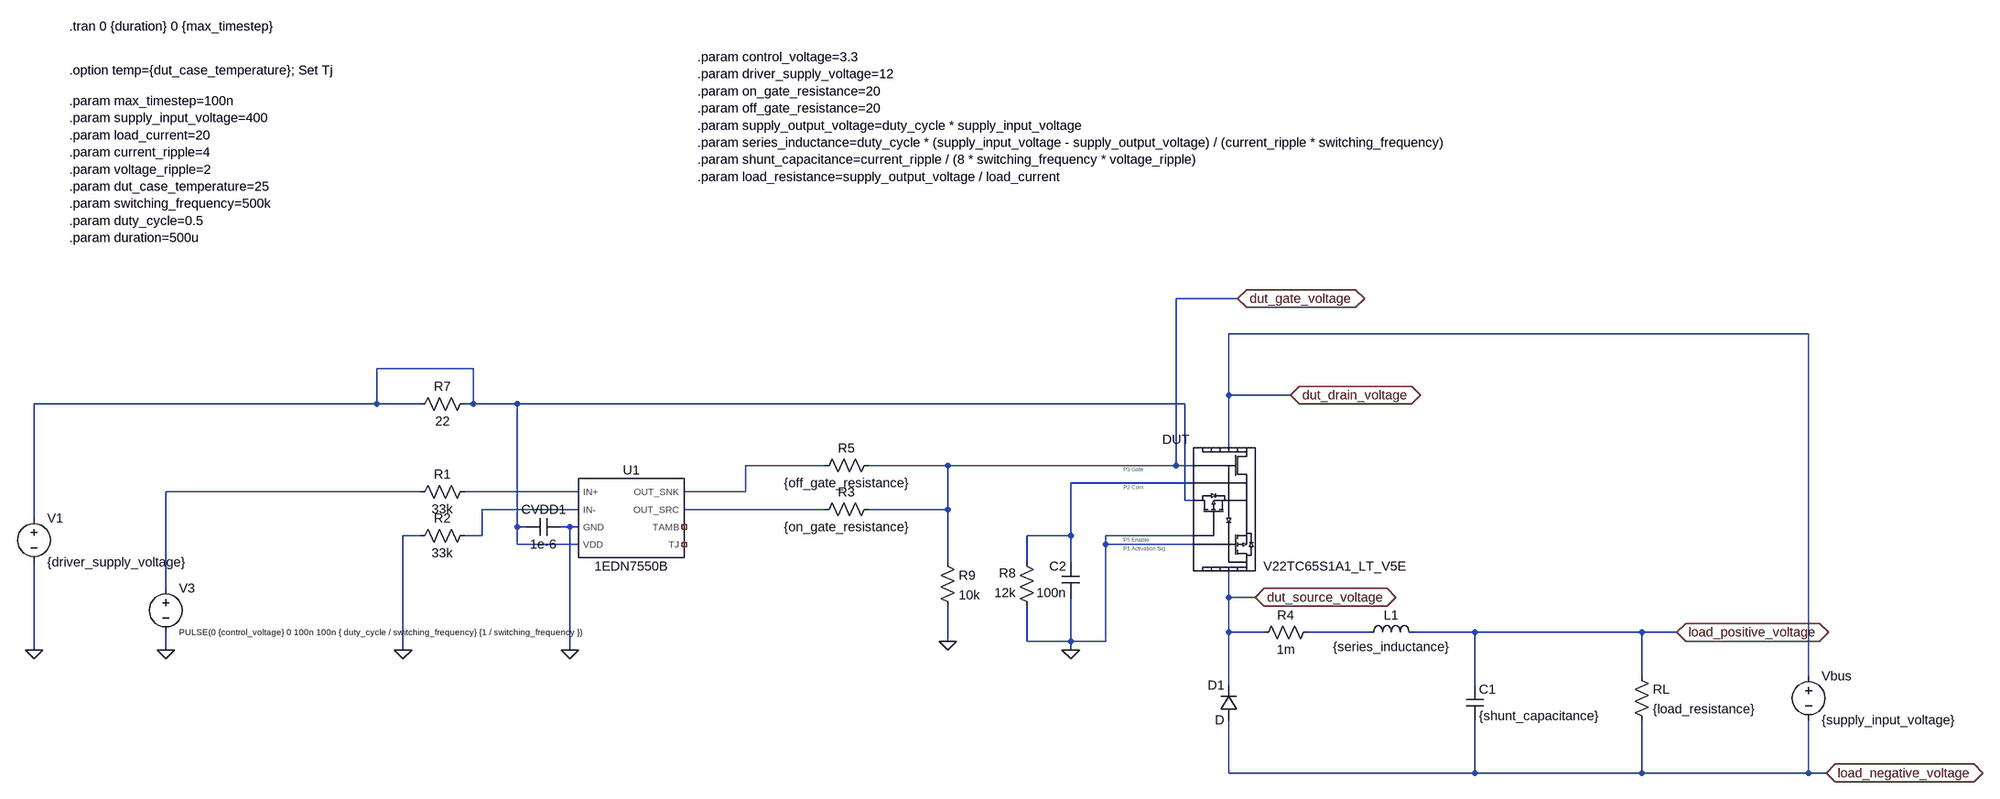
[diagram p0: schematic buck_converter_gan_v22tc65s1a1.asc]
buck_converter_gan_v22tc65s1a1.asc, the LTspice schematic file:
Version 4
SHEET 1 2260 1096
WIRE 864 160 752 160
WIRE 1904 224 848 224
WIRE -528 288 -704 288
WIRE 848 336 848 224
WIRE 960 336 848 336
WIRE -704 352 -704 288
WIRE -704 352 -1328 352
WIRE -624 352 -704 352
WIRE -528 352 -528 288
WIRE -528 352 -544 352
WIRE -448 352 -528 352
WIRE 768 352 -448 352
WIRE 848 432 848 336
WIRE 112 464 -32 464
WIRE 336 464 192 464
WIRE 752 464 752 160
WIRE 752 464 336 464
WIRE 784 464 752 464
WIRE 784 496 560 496
WIRE -624 512 -1088 512
WIRE -336 512 -544 512
WIRE -32 512 -32 464
WIRE -32 512 -144 512
WIRE 768 528 768 352
WIRE 784 528 768 528
WIRE -336 544 -512 544
WIRE 112 544 -144 544
WIRE 336 544 336 464
WIRE 336 544 192 544
WIRE -1328 560 -1328 352
WIRE -448 576 -448 352
WIRE -432 576 -448 576
WIRE -352 576 -368 576
WIRE -336 576 -352 576
WIRE -624 592 -656 592
WIRE -512 592 -512 544
WIRE -512 592 -544 592
WIRE 560 592 560 496
WIRE 560 592 480 592
WIRE 784 592 624 592
WIRE -448 608 -448 576
WIRE -336 608 -448 608
WIRE 624 608 624 592
WIRE 784 608 624 608
WIRE 336 640 336 544
WIRE 480 640 480 592
WIRE 560 640 560 592
WIRE -1088 688 -1088 512
WIRE 848 704 848 656
WIRE 896 704 848 704
WIRE 848 768 848 704
WIRE 912 768 848 768
WIRE 1104 768 992 768
WIRE 1296 768 1184 768
WIRE 1600 768 1296 768
WIRE 1664 768 1600 768
WIRE 336 784 336 720
WIRE 480 784 480 720
WIRE 560 784 560 704
WIRE 560 784 480 784
WIRE 624 784 624 608
WIRE 624 784 560 784
WIRE -1328 800 -1328 640
WIRE -1088 800 -1088 768
WIRE -656 800 -656 592
WIRE -352 800 -352 576
WIRE 560 800 560 784
WIRE 1600 848 1600 768
WIRE 1904 848 1904 224
WIRE 848 864 848 768
WIRE 1296 864 1296 768
WIRE 848 1024 848 928
WIRE 1296 1024 1296 928
WIRE 1296 1024 848 1024
WIRE 1600 1024 1600 928
WIRE 1600 1024 1296 1024
WIRE 1904 1024 1904 928
WIRE 1904 1024 1600 1024
WIRE 1936 1024 1904 1024
FLAG -656 800 0
FLAG -1088 800 0
FLAG -1328 800 0
FLAG -352 800 0
FLAG 960 336 dut_drain_voltage
IOPIN 960 336 BiDir
FLAG 896 704 dut_source_voltage
IOPIN 896 704 BiDir
FLAG 864 160 dut_gate_voltage
IOPIN 864 160 BiDir
FLAG 560 800 0
FLAG 336 784 0
FLAG 1936 1024 load_negative_voltage
IOPIN 1936 1024 BiDir
FLAG 1664 768 load_positive_voltage
IOPIN 1664 768 BiDir
SYMBOL 1EDN7550B -240 560 R0
SYMATTR InstName U1
SYMBOL res -528 496 R90
WINDOW 0 0 56 VBottom 2
WINDOW 3 32 56 VTop 2
SYMATTR InstName R1
SYMATTR Value 33k
SYMBOL res -528 576 R90
WINDOW 0 0 56 VBottom 2
WINDOW 3 32 56 VTop 2
SYMATTR InstName R2
SYMATTR Value 33k
SYMBOL cap -368 560 R90
WINDOW 0 0 32 VBottom 2
WINDOW 3 32 32 VTop 2
SYMATTR InstName CVDD1
SYMATTR Value 1e-6
SYMBOL voltage -1328 544 R0
WINDOW 123 0 0 Left 0
WINDOW 39 0 0 Left 0
SYMATTR InstName V1
SYMATTR Value {driver_supply_voltage}
SYMBOL res 208 528 R90
WINDOW 0 0 56 VBottom 2
WINDOW 3 32 56 VTop 2
SYMATTR InstName R3
SYMATTR Value {on_gate_resistance}
SYMBOL voltage 1904 832 R0
WINDOW 123 0 0 Left 0
WINDOW 39 0 0 Left 0
SYMATTR InstName Vbus
SYMATTR Value {supply_input_voltage}
SYMBOL res 1008 752 R90
WINDOW 0 0 56 VBottom 2
WINDOW 3 32 56 VTop 2
SYMATTR InstName R4
SYMATTR Value 1m
SYMBOL ind 1088 784 R270
WINDOW 0 32 56 VTop 2
WINDOW 3 5 56 VBottom 2
SYMATTR InstName L1
SYMATTR Value {series_inductance}
SYMBOL diode 864 928 R180
WINDOW 0 24 64 Left 2
WINDOW 3 24 0 Left 2
SYMATTR InstName D1
SYMBOL res 208 448 R90
WINDOW 0 0 56 VBottom 2
WINDOW 3 32 56 VTop 2
SYMATTR InstName R5
SYMATTR Value {off_gate_resistance}
SYMBOL voltage -1088 672 R0
WINDOW 123 0 0 Left 0
WINDOW 39 0 0 Left 0
WINDOW 3 24 96 Left 1
SYMATTR Value PULSE(0 {control_voltage} 0 100n 100n { duty_cycle / switching_frequency} {1 / switching_frequency })
SYMATTR InstName V3
SYMBOL res -528 336 R90
WINDOW 0 0 56 VBottom 2
WINDOW 3 32 56 VTop 2
SYMATTR InstName R7
SYMATTR Value 22
SYMBOL cap 1280 864 R0
SYMATTR InstName C1
SYMATTR Value {shunt_capacitance}
SYMBOL res 1584 832 R0
SYMATTR InstName RL
SYMATTR Value {load_resistance}
SYMBOL V22TC65S1A1_LT_V5E 848 528 R0
WINDOW 3 194 104 Top 2
SYMATTR InstName DUT
SYMBOL cap 576 704 R180
WINDOW 0 24 56 Left 2
WINDOW 3 24 8 Left 2
SYMATTR InstName C2
SYMATTR Value 100n
SYMBOL res 496 736 R180
WINDOW 0 36 76 Left 2
WINDOW 3 36 40 Left 2
SYMATTR InstName R8
SYMATTR Value 12k
SYMBOL res 320 624 R0
SYMATTR InstName R9
SYMATTR Value 10k
TEXT -1264 -336 Left 2 !.tran 0 {duration} 0 {max_timestep}
TEXT -1264 -256 Left 2 !.option temp={dut_case_temperature}; Set Tj
TEXT -1264 -200 Left 2 !.param max_timestep=100n\n.param supply_input_voltage=400\n.param load_current=20\n.param current_ripple=4\n.param voltage_ripple=2\n.param dut_case_temperature=25\n.param switching_frequency=500k\n.param duty_cycle=0.5\n.param duration=500u
TEXT -120 -280 Left 2 !.param control_voltage=3.3\n.param driver_supply_voltage=12\n.param on_gate_resistance=20\n.param off_gate_resistance=20\n.param supply_output_voltage=duty_cycle * supply_input_voltage\n.param series_inductance=duty_cycle * (supply_input_voltage - supply_output_voltage) / (current_ripple * switching_frequency)\n.param shunt_capacitance=current_ripple / (8 * switching_frequency * voltage_ripple)\n.param load_resistance=supply_output_voltage / load_current
TEXT 656 504 Left 0 ;P2 Com
TEXT 656 472 Left 0 ;P3 Gate
TEXT 656 600 Left 0 ;P5 Enable
TEXT 656 616 Left 0 ;P1 Activation Sig.

The netlist it stands for:
* buck_converter_gan_v22tc65s1a1.asc
XU1 N005 N006 0 N001 N002 N007 NC_01 NC_02 1EDN7550B  ; pins IN+ IN- GND VDD OUT_SNK OUT_SRC TAMB TJ
R1 N005 N004 33k
R2 N006 0 33k
CVDD1 0 N001 1e-6
V1 N001 0 {driver_supply_voltage}
R3 dut_gate_voltage N007 {on_gate_resistance}
Vbus dut_drain_voltage load_negative_voltage {supply_input_voltage}
R4 N008 dut_source_voltage 1m
L1 N008 load_positive_voltage {series_inductance}
D1 load_negative_voltage dut_source_voltage D
R5 dut_gate_voltage N002 {off_gate_resistance}
V3 N004 0 PULSE(0 {control_voltage} 0 100n 100n { duty_cycle / switching_frequency} {1 / switching_frequency })
R7 N001 N001 22
C1 load_positive_voltage load_negative_voltage {shunt_capacitance}
RL load_positive_voltage load_negative_voltage {load_resistance}
XDUT 0 N003 dut_gate_voltage N001 0 dut_drain_voltage dut_source_voltage V22TC65S1A1_LT_V5E  ; pins As Cs G Cp En D S
C2 0 N003 100n
R8 0 N003 12k
R9 dut_gate_voltage 0 10k
.model D D
.lib standard.dio
.tran 0 {duration} 0 {max_timestep}
.option temp={dut_case_temperature}; Set Tj
.param max_timestep=100n
.param supply_input_voltage=400
.param load_current=20
.param current_ripple=4
.param voltage_ripple=2
.param dut_case_temperature=25
.param switching_frequency=500k
.param duty_cycle=0.5
.param duration=500u
.param control_voltage=3.3
.param driver_supply_voltage=12
.param on_gate_resistance=20
.param off_gate_resistance=20
.param supply_output_voltage=duty_cycle * supply_input_voltage
.param series_inductance=duty_cycle * (supply_input_voltage - supply_output_voltage) / (current_ripple * switching_frequency)
.param shunt_capacitance=current_ripple / (8 * switching_frequency * voltage_ripple)
.param load_resistance=supply_output_voltage / load_current
* P2 Com
* P3 Gate
* P5 Enable
* P1 Activation Sig.
.lib C:\Users\joshu\OneDrive - Stellenbosch University\Obsidian\Postgraduate Vault\Areas\RU Electronics and Drives\Resources\Spice Models\Infineon-Non_isolated_Gate_Driver_IC_1EDN7550B_Spice-SimulationModels-v01_00-EN\Model\1EDN7550B.lib
.lib V22TC65S1A1_LT_V5E.lib
.backanno
.end